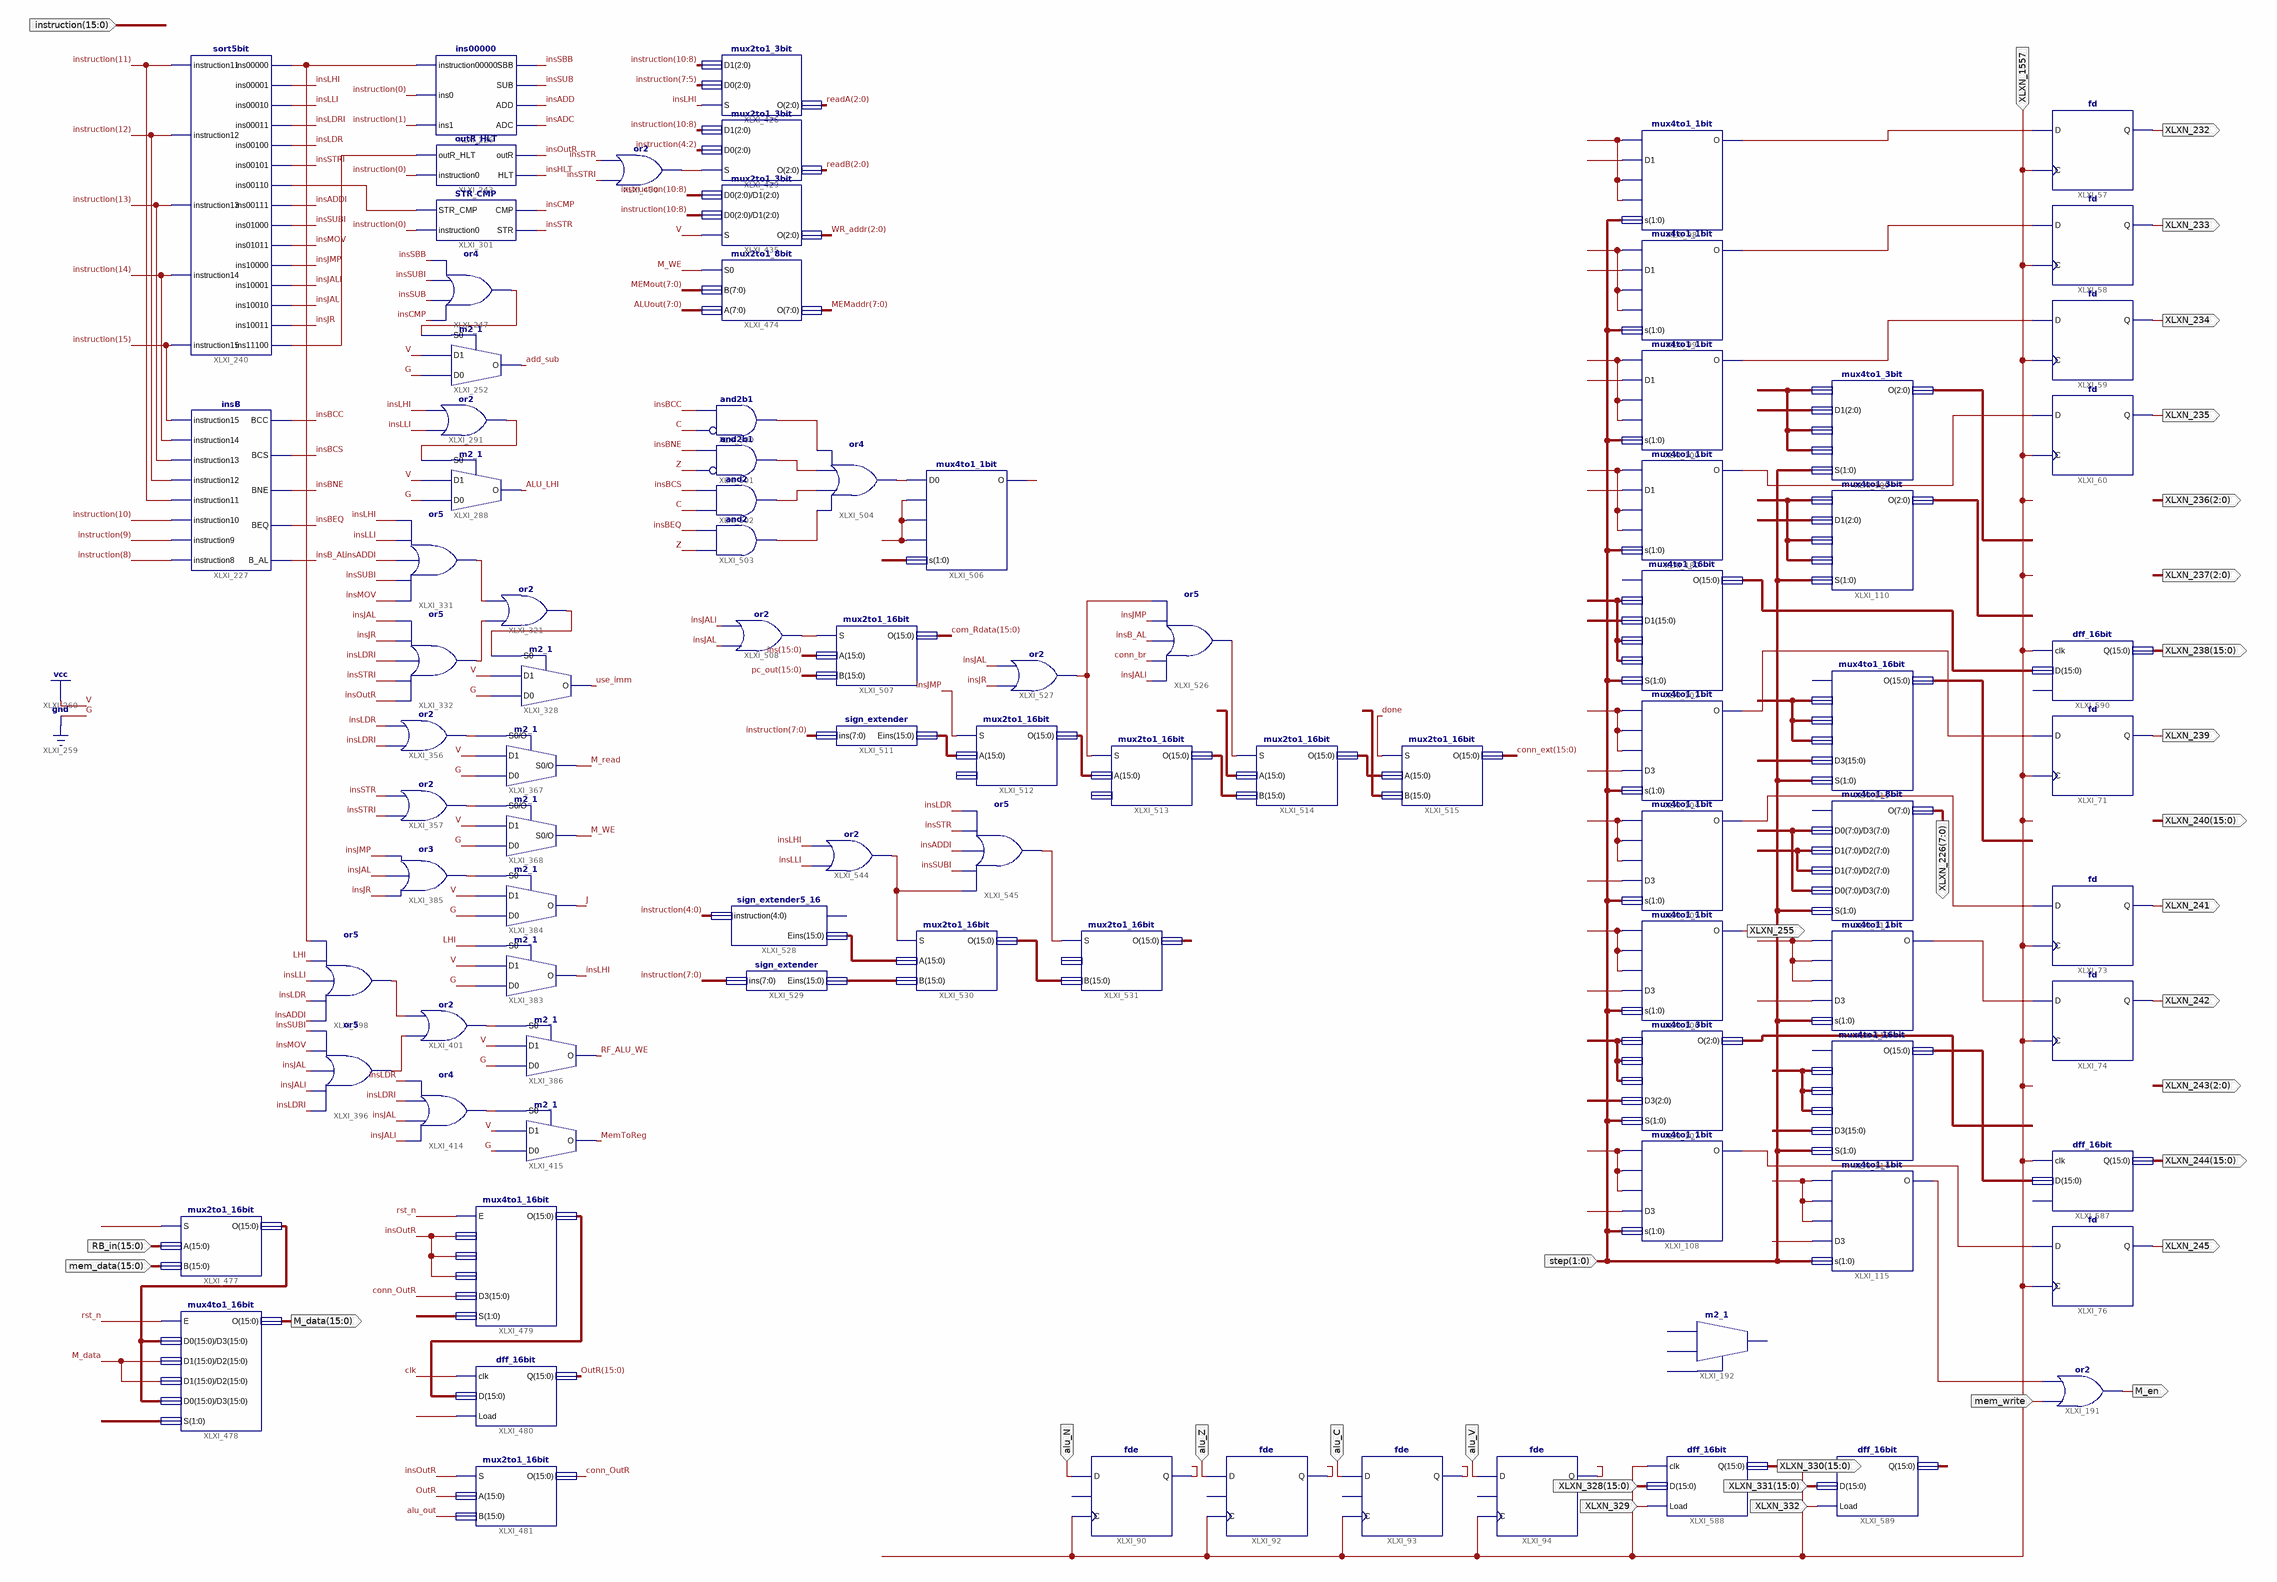
[diagram p0: schematic sheet 1]
// Xilinx ISE schematic ID.sch (spartan6) as structural Verilog: 92 symbols, 33 ports
module ID (
  input  [15:0] instruction,
  input  [15:0] RB_in,
  input  [15:0] mem_data,
  input  alu_N,
  input  alu_Z,
  input  alu_C,
  input  alu_V,
  input  XLXN_1557,
  input  mem_write,
  input  [1:0] step,
  input  [15:0] XLXN_328,
  input  XLXN_329,
  input  [15:0] XLXN_331,
  input  XLXN_332,
  output [15:0] M_data,
  output [7:0] XLXN_226,
  output XLXN_232,
  output XLXN_233,
  output XLXN_234,
  output XLXN_235,
  output [2:0] XLXN_236,
  output [2:0] XLXN_237,
  output [15:0] XLXN_238,
  output XLXN_239,
  output [15:0] XLXN_240,
  output XLXN_241,
  output XLXN_242,
  output [2:0] XLXN_243,
  output [15:0] XLXN_244,
  output XLXN_245,
  output XLXN_255,
  output M_en,
  output [15:0] XLXN_330
);

  wire add_sub, ALU_LHI, alu_out, C, clk, conn_br, conn_OutR, done, insADC, insADD, insADDI, insB_AL, insBCC,
       insBCS, insBEQ, insBNE, insCMP, insHLT, insJAL, insJALl, insJMP, insJR, insLDR, insLDRI, insLHI,
       insLLI, insMOV, insOutR, insSBB, insSTR, insSTRI, insSUB, insSUBI, J, LHI, M_data_1bit, M_read, M_WE,
       MemToReg, OutR_1bit, OutR_HLT, RF_ALU_WE, rst_n, STR_CMP, use_imm, XLXN_213, XLXN_214, XLXN_215,
       XLXN_216, XLXN_224, XLXN_227, XLXN_228, XLXN_251, XLXN_252, XLXN_253, XLXN_254, XLXN_256, XLXN_257,
       XLXN_264, XLXN_266, XLXN_268, XLXN_270, XLXN_272, XLXN_273, XLXN_275, XLXN_276, XLXN_280, XLXN_281,
       XLXN_283, XLXN_284, XLXN_286, XLXN_287, XLXN_294, XLXN_296, XLXN_316, XLXN_317, XLXN_324, XLXN_325,
       XLXN_521, XLXN_586, XLXN_730, XLXN_772, XLXN_773, XLXN_947, XLXN_958, XLXN_1000, XLXN_1120, XLXN_1121,
       XLXN_1128, XLXN_1352, XLXN_1356, XLXN_1414, XLXN_1415, XLXN_1416, XLXN_1417, XLXN_1418, XLXN_1419,
       XLXN_1422, XLXN_1423, XLXN_1446, XLXN_1475, XLXN_1497, XLXN_1515, Z;
  wire [1:0] XLXN_1347, XLXN_1360, XLXN_1421;
  wire [2:0] readA, readB, WR_addr, XLXN_220, XLXN_221, XLXN_231, XLXN_288, XLXN_289, XLXN_300, XLXN_301,
       XLXN_303, XLXN_305;
  wire [7:0] ALUout, MEMaddr, MEMout, XLXN_311, XLXN_313;
  wire [15:0] com_Rdata, conn_ext, ins, OutR, pc_out, XLXN_223, XLXN_225, XLXN_230, XLXN_277, XLXN_278,
       XLXN_308, XLXN_310, XLXN_320, XLXN_321, XLXN_333, XLXN_1344, XLXN_1353, XLXN_1437, XLXN_1438,
       XLXN_1440, XLXN_1441, XLXN_1444, XLXN_1480, XLXN_1481, XLXN_1482, XLXN_1520, XLXN_1521;

  ins00000 XLXI_226 (
    .instruction00000(XLXN_1000), .ins0(instruction[0]), .ins1(instruction[1]), .SBB(insSBB), .SUB(insSUB),
    .ADD(insADD), .ADC(insADC));
  insB XLXI_227 (
    .B_AL(insB_AL), .BEQ(insBEQ), .BNE(insBNE), .BCS(insBCS), .BCC(insBCC), .instruction15(instruction[15]),
    .instruction14(instruction[14]), .instruction13(instruction[13]), .instruction12(instruction[12]),
    .instruction11(instruction[11]), .instruction10(instruction[10]), .instruction9(instruction[9]),
    .instruction8(instruction[8]));
  sort5bit XLXI_240 (
    .instruction11(instruction[11]), .instruction12(instruction[12]), .ins00000(XLXN_1000),
    .ins00001(insLHI), .ins00010(insLLI), .ins00011(insLDRI), .ins00100(insLDR), .ins00101(insSTRI),
    .ins00110(STR_CMP), .ins00111(insADDI), .ins01000(insSUBI), .ins01011(insMOV), .ins10000(insJMP),
    .ins10001(insJALl), .ins10010(insJAL), .ins10011(insJR), .ins11100(OutR_HLT),
    .instruction13(instruction[13]), .instruction15(instruction[15]), .instruction14(instruction[14]));
  outR_HLT XLXI_243 (.instruction0(instruction[0]), .outR_HLT(OutR_HLT), .HLT(insHLT), .outR(insOutR));
  STR_CMP XLXI_301 (.instruction0(instruction[0]), .STR_CMP(STR_CMP), .STR(insSTR), .CMP(insCMP));
  m2_1 XLXI_252 (.D0(1'b0), .D1(1'b1), .S0(XLXN_521), .O(add_sub));
  or XLXI_291 (XLXN_586, insLLI, insLHI);
  m2_1 XLXI_288 (.D0(1'b0), .D1(1'b1), .S0(XLXN_586), .O(ALU_LHI));
  or XLXI_247 (XLXN_521, insSBB, insSUBI, insSUB, insCMP);
  or XLXI_331 (XLXN_772, insLHI, insLLI, insADDI, insSUBI, insMOV);
  or XLXI_332 (XLXN_773, insJAL, insJR, insLDRI, insSTRI, insOutR);
  or XLXI_321 (XLXN_730, XLXN_772, XLXN_773);
  m2_1 XLXI_328 (.D0(1'b0), .D1(1'b1), .S0(XLXN_730), .O(use_imm));
  or XLXI_356 (M_read, insLDR, insLDRI);
  m2_1 XLXI_367 (.D0(1'b0), .D1(1'b1), .S0(M_read), .O(M_read));
  or XLXI_357 (M_WE, insSTR, insSTRI);
  m2_1 XLXI_368 (.D0(1'b0), .D1(1'b1), .S0(M_WE), .O(M_WE));
  or XLXI_385 (XLXN_947, insJMP, insJAL, insJR);
  m2_1 XLXI_384 (.D0(1'b0), .D1(1'b1), .S0(XLXN_947), .O(J));
  m2_1 XLXI_383 (.D0(1'b0), .D1(1'b1), .S0(LHI), .O(insLHI));
  or XLXI_401 (XLXN_958, XLXN_1120, XLXN_1121);
  or XLXI_398 (XLXN_1120, XLXN_1000, LHI, insLLI, insLDR, insADDI);
  m2_1 XLXI_386 (.D0(1'b0), .D1(1'b1), .S0(XLXN_958), .O(RF_ALU_WE));
  or XLXI_396 (XLXN_1121, insSUBI, insMOV, insJAL, insJALl, insLDRI);
  or XLXI_414 (XLXN_1128, insLDR, insLDRI, insJAL, insJALl);
  m2_1 XLXI_415 (.D0(1'b0), .D1(1'b1), .S0(XLXN_1128), .O(MemToReg));
  mux2to1_3bit XLXI_426 (.S(insLHI), .D0(instruction[7:5]), .D1(instruction[10:8]), .O(readA));
  mux2to1_3bit XLXI_429 (.S(insSTR), .D0(instruction[4:2]), .D1(instruction[10:8]), .O(readB));
  or XLXI_430 (insSTR, insSTR, insSTRI);
  mux2to1_3bit XLXI_435 (.S(1'b1), .D0(instruction[10:8]), .D1(instruction[10:8]), .O(WR_addr));
  mux2to1_8bit XLXI_474 (.A(ALUout), .B(MEMout), .S0(M_WE), .O(MEMaddr));
  mux2to1_16bit XLXI_477 (.S(XLXN_1352), .A(RB_in), .B(mem_data), .O(XLXN_1344));
  mux4to1_16bit XLXI_478 (
    .E(rst_n), .D0(XLXN_1344), .D1({16{M_data_1bit}}), .D2({16{M_data_1bit}}), .D3(XLXN_1344), .S(XLXN_1347),
    .O(M_data));
  mux4to1_16bit XLXI_479 (
    .E(rst_n), .D0({16{insOutR}}), .D1({16{insOutR}}), .D2({16{insOutR}}), .D3({16{conn_OutR}}),
    .S(XLXN_1360), .O(XLXN_1353));
  dff_16bit XLXI_480 (.clk(clk), .D(XLXN_1353), .Load(XLXN_1356), .Q(OutR));
  mux2to1_16bit XLXI_481 (.S(insOutR), .A({16{OutR_1bit}}), .B({16{alu_out}}), .O(conn_OutR));
  and XLXI_500 (XLXN_1414, ~C, insBCC);  // and2b1
  and XLXI_501 (XLXN_1415, ~Z, insBNE);  // and2b1
  and XLXI_502 (XLXN_1416, C, insBCS);
  and XLXI_503 (XLXN_1417, Z, insBEQ);
  or XLXI_504 (XLXN_1418, XLXN_1417, XLXN_1416, XLXN_1415, XLXN_1414);
  mux4to1_1bit XLXI_506 (.D0(XLXN_1418), .D1(XLXN_1419), .D2(XLXN_1419), .D3(XLXN_1419), .s(XLXN_1421), .O(XLXN_1422));
  mux2to1_16bit XLXI_507 (.S(XLXN_1423), .A(ins), .B(pc_out), .O(com_Rdata));
  or XLXI_508 (XLXN_1423, insJAL, insJALl);
  mux2to1_16bit XLXI_512 (.S(insJMP), .A(XLXN_1437), .O(XLXN_1438));  // open: B
  mux2to1_16bit XLXI_513 (.S(XLXN_1475), .A(XLXN_1438), .O(XLXN_1440));  // open: B
  sign_extender XLXI_511 (.ins(instruction[7:0]), .Eins(XLXN_1437));
  mux2to1_16bit XLXI_514 (.S(XLXN_1446), .A(XLXN_1444), .B(XLXN_1440), .O(XLXN_1441));
  mux2to1_16bit XLXI_515 (.S(done), .A(XLXN_1441), .B(XLXN_1480), .O(conn_ext));
  or XLXI_526 (XLXN_1446, insJALl, conn_br, insB_AL, insJMP, XLXN_1475);
  or XLXI_527 (XLXN_1475, insJR, insJAL);
  or XLXI_545 (XLXN_1515, XLXN_1497, insSUBI, insADDI, insSTR, insLDR);
  sign_extender5_16 XLXI_528 (.instruction({instruction[4], 1'bz, instruction[3:0]}), .Eins(XLXN_1481));
  sign_extender XLXI_529 (.ins(instruction[7:0]), .Eins(XLXN_1482));
  or XLXI_544 (XLXN_1497, insLLI, insLHI);
  mux2to1_16bit XLXI_530 (.S(XLXN_1497), .A(XLXN_1481), .B(XLXN_1482), .O(XLXN_1520));
  mux2to1_16bit XLXI_531 (.S(XLXN_1515), .B(XLXN_1520), .O(XLXN_1521));  // open: A
  fde XLXI_93 (.C(XLXN_1557), .D(alu_C), .Q(XLXN_215));  // open: CE
  fde XLXI_94 (.C(XLXN_1557), .D(alu_V), .Q(XLXN_216));  // open: CE
  fde XLXI_92 (.C(XLXN_1557), .D(alu_Z), .Q(XLXN_214));  // open: CE
  fde XLXI_90 (.C(XLXN_1557), .D(alu_N), .Q(XLXN_213));  // open: CE
  mux4to1_1bit XLXI_99 (.D0(XLXN_270), .D1(XLXN_268), .D2(XLXN_270), .D3(XLXN_270), .s(step), .O(XLXN_252));
  mux4to1_1bit XLXI_100 (.D0(XLXN_273), .D1(XLXN_272), .D2(XLXN_273), .D3(XLXN_273), .s(step), .O(XLXN_253));
  mux4to1_3bit XLXI_109 (.D0(XLXN_300), .D1(XLXN_301), .D2(XLXN_300), .D3(XLXN_300), .S(step), .O(XLXN_220));
  mux4to1_3bit XLXI_110 (.D0(XLXN_303), .D1(XLXN_305), .D2(XLXN_303), .D3(XLXN_303), .S(step), .O(XLXN_221));
  mux4to1_1bit XLXI_98 (.D0(XLXN_266), .D1(XLXN_264), .D2(XLXN_266), .D3(XLXN_266), .s(step), .O(XLXN_251));
  fd XLXI_57 (.C(XLXN_1557), .D(XLXN_251), .Q(XLXN_232));
  fd XLXI_58 (.C(XLXN_1557), .D(XLXN_252), .Q(XLXN_233));
  fd XLXI_59 (.C(XLXN_1557), .D(XLXN_253), .Q(XLXN_234));
  fd XLXI_60 (.C(XLXN_1557), .D(XLXN_254), .Q(XLXN_235));
  fd XLXI_71 (.C(XLXN_1557), .D(XLXN_224), .Q(XLXN_239));
  fd XLXI_73 (.C(XLXN_1557), .D(XLXN_228), .Q(XLXN_241));
  fd XLXI_74 (.C(XLXN_1557), .D(XLXN_227), .Q(XLXN_242));
  fd XLXI_76 (.C(XLXN_1557), .D(XLXN_256), .Q(XLXN_245));
  mux4to1_16bit XLXI_111 (
    .D0(XLXN_308), .D1(XLXN_308), .D2(XLXN_308), .D3(XLXN_310), .S(step), .O(XLXN_225));  // open: E
  mux4to1_8bit XLXI_112 (
    .D0(XLXN_311), .D1(XLXN_313), .D2(XLXN_313), .D3(XLXN_311), .S(step), .O(XLXN_226));  // open: E
  mux4to1_1bit XLXI_113 (.D0(XLXN_324), .D1(XLXN_324), .D2(XLXN_324), .D3(XLXN_325), .s(step), .O(XLXN_227));
  mux4to1_16bit XLXI_114 (
    .D0(XLXN_320), .D1(XLXN_320), .D2(XLXN_320), .D3(XLXN_321), .S(step), .O(XLXN_230));  // open: E
  mux4to1_1bit XLXI_115 (.D0(XLXN_316), .D1(XLXN_316), .D2(XLXN_316), .D3(XLXN_317), .s(step), .O(XLXN_257));
  mux4to1_1bit XLXI_180 (.D0(XLXN_276), .D1(XLXN_275), .D2(XLXN_276), .D3(XLXN_276), .s(step), .O(XLXN_254));
  mux4to1_16bit XLXI_103 (
    .D0(XLXN_277), .D1(XLXN_278), .D2(XLXN_277), .D3(XLXN_277), .S(step), .O(XLXN_223));  // open: E
  mux4to1_1bit XLXI_104 (.D0(XLXN_281), .D1(XLXN_281), .D2(XLXN_281), .D3(XLXN_280), .s(step), .O(XLXN_224));
  mux4to1_1bit XLXI_105 (.D0(XLXN_284), .D1(XLXN_284), .D2(XLXN_284), .D3(XLXN_283), .s(step), .O(XLXN_228));
  mux4to1_1bit XLXI_106 (.D0(XLXN_287), .D1(XLXN_287), .D2(XLXN_287), .D3(XLXN_286), .s(step), .O(XLXN_255));
  mux4to1_3bit XLXI_107 (.D0(XLXN_288), .D1(XLXN_288), .D2(XLXN_288), .D3(XLXN_289), .S(step), .O(XLXN_231));
  mux4to1_1bit XLXI_108 (.D0(XLXN_294), .D1(XLXN_294), .D2(XLXN_294), .D3(XLXN_296), .s(step), .O(XLXN_256));
  or XLXI_191 (M_en, mem_write, XLXN_257);
  m2_1 XLXI_192 ();  // open: D0, D1, S0, O
  dff_16bit XLXI_587 (.clk(XLXN_1557), .D(XLXN_230), .Q(XLXN_244));  // open: Load
  dff_16bit XLXI_588 (.clk(XLXN_1557), .D(XLXN_328), .Load(XLXN_329), .Q(XLXN_330));
  dff_16bit XLXI_589 (.clk(XLXN_1557), .D(XLXN_331), .Load(XLXN_332), .Q(XLXN_333));
  dff_16bit XLXI_590 (.clk(XLXN_1557), .D(XLXN_223), .Q(XLXN_238));  // open: Load
endmodule
